# Altium project PaspberryPi_Breakout_V2_1.PrjPcb
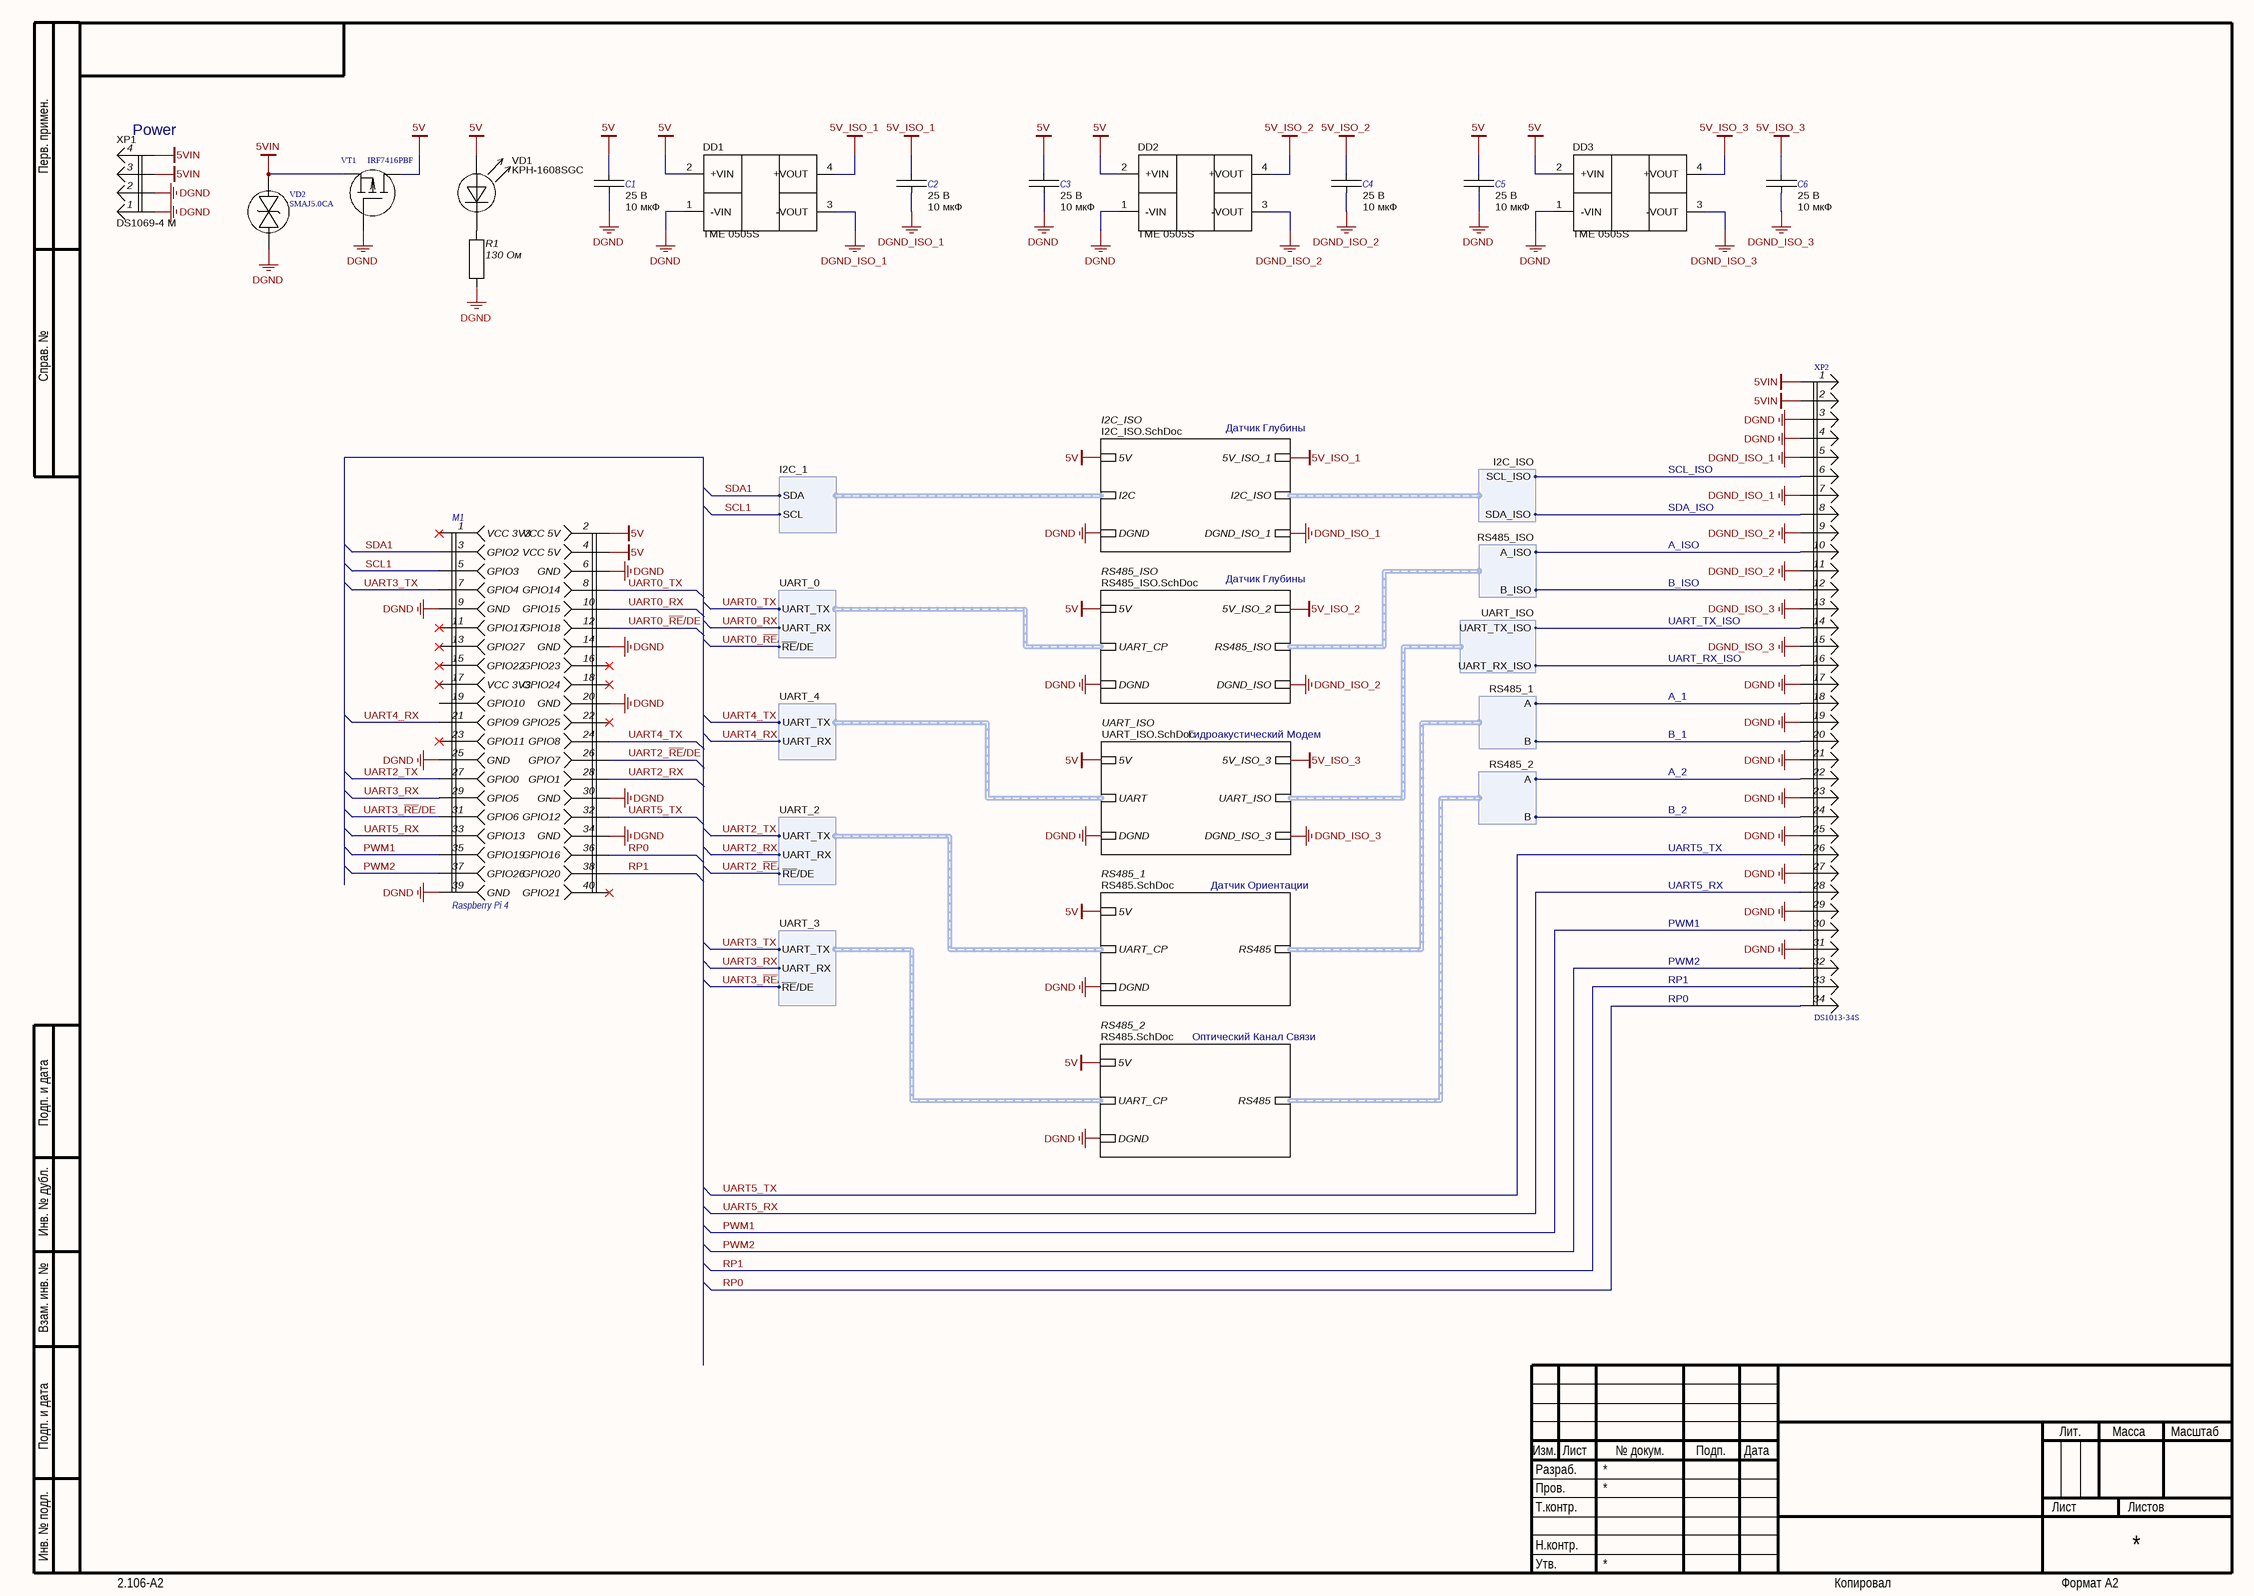
[diagram p0: Main.SchDoc]
5 sheets, 45 parts. Net scope: hierarchical (ports join the sheet entries above them; power ports are global).
Board file: PI4MB_HAT_V2_1.PcbDoc
Sheets:
  Main.SchDoc
    RS485_1 = RS485.SchDoc
    RS485_ISO = RS485_ISO.SchDoc
    UART_ISO = UART_ISO.SchDoc
    I2C_ISO = I2C_ISO.SchDoc
    RS485_2 = RS485.SchDoc

## Sheet Main.SchDoc
size 594 x 420 mm; Organization: Altium Limited; Address1: L3, 12a Rodborough Rd; Address2: Frenchs Forest; Address3: NSW; Address4: Australia 2086

### Parts
C1  Voltage: 25 В  [C1206C]  (hidden comment: 10 мкФ)
C2  Voltage: 25 В  [C1206C]  (hidden comment: 10 мкФ)
C3  Voltage: 25 В  [C1206C]  (hidden comment: 10 мкФ)
C4  Voltage: 25 В  [C1206C]  (hidden comment: 10 мкФ)
C5  Voltage: 25 В  [C1206C]  (hidden comment: 10 мкФ)
C6  Voltage: 25 В  [C1206C]  (hidden comment: 10 мкФ)
DD1  TME 0505S  [TME-1W-SINGLE]
DD2  TME 0505S  [TME-1W-SINGLE]
DD3  TME 0505S  [TME-1W-SINGLE]
M1  Raspberry Pi 4  [Raspberry Pi 4]
R1  130 Ом  [C0603R]
VD1  KPH-1608SGC  [LED_0603]
VD2  SMAJ5.0CA  [DO-214AC]
VT1  IRF7416PBF  [SOIC-8]
XP1  DS1069-4 M  [DS1069-4 M]
XP2  DS1013-34S  [IDC-34MS]

### Sub-sheets
I2C_ISO = I2C_ISO.SchDoc: DGND, 5V, I2C (harness I2C_1), 5V_ISO_1, I2C_ISO (harness I2C_ISO), DGND_ISO_1
RS485_1 = RS485.SchDoc: DGND, 5V, UART_CP (harness UART_2), RS485 (harness RS485_1)
RS485_2 = RS485.SchDoc: DGND, 5V, UART_CP (harness UART_3), RS485 (harness RS485_2)
RS485_ISO = RS485_ISO.SchDoc: DGND, 5V, UART_CP (harness UART_0), 5V_ISO_2, DGND_ISO, RS485_ISO (harness RS485_ISO)
UART_ISO = UART_ISO.SchDoc: DGND, 5V, UART (harness UART_4), DGND_ISO_3, UART_ISO (harness UART_ISO), 5V_ISO_3

### Harnesses
I2C_1: SDA, SCL
I2C_ISO: SDA_ISO, SCL_ISO
UART_2: UART_TX, UART_RX, ~{RE}/DE
UART_4: UART_TX, UART_RX
UART_0: UART_TX, UART_RX, ~{RE}/DE
UART_3: ~{RE}/DE, UART_RX, UART_TX
RS485_ISO: B_ISO, A_ISO
UART_ISO: UART_TX_ISO, UART_RX_ISO
RS485_1: B, A
RS485_2: B, A

### Nets
5V: C1.1 C3.1 C5.1 DD1.2(+VIN) DD2.2(+VIN) DD3.2(+VIN) M1.2(VCC_5V) M1.4(VCC_5V) VD1.2 VT1.5(D) ; sheet RS485_1/5V, sheet RS485_ISO/5V, sheet UART_ISO/5V, sheet I2C_ISO/5V, sheet RS485_2/5V
5V_ISO_1: C2.1 DD1.4(+VOUT) ; sheet I2C_ISO/5V_ISO_1
5V_ISO_2: C4.1 DD2.4(+VOUT) ; sheet RS485_ISO/5V_ISO_2
5V_ISO_3: C6.1 DD3.4(+VOUT) ; sheet UART_ISO/5V_ISO_3
5VIN: VD2.1(C) VT1.1(S) XP1.3 XP1.4 XP2.1 XP2.2
D: VT1.6(D) VT1.7(D) VT1.8(D)
DGND: C1.2 C3.2 C5.2 DD1.1(-VIN) DD2.1(-VIN) DD3.1(-VIN) M1.6(GND) M1.9(GND) M1.14(GND) M1.20(GND) M1.25(GND) M1.30(GND) M1.34(GND) M1.39(GND) R1.2 VD2.2(A) VT1.4(G) XP1.1 XP1.2 XP2.3 XP2.4 XP2.17 XP2.19 XP2.21 XP2.23 XP2.25 XP2.27 XP2.29 XP2.31 ; sheet RS485_1/DGND, sheet RS485_ISO/DGND, sheet UART_ISO/DGND, sheet I2C_ISO/DGND, sheet RS485_2/DGND
DGND_ISO_1: C2.2 DD1.3(-VOUT) XP2.5 XP2.7 ; sheet I2C_ISO/DGND_ISO_1
DGND_ISO_2: C4.2 DD2.3(-VOUT) XP2.9 XP2.11 ; sheet RS485_ISO/DGND_ISO
DGND_ISO_3: C6.2 DD3.3(-VOUT) XP2.13 XP2.15 ; sheet UART_ISO/DGND_ISO_3
S: VT1.2(S) VT1.3(S)
PWM1: M1.35(GPIO19) XP2.30
PWM2: M1.37(GPIO26) XP2.32
RP0: M1.36(GPIO16) XP2.34
RP1: M1.38(GPIO20) XP2.33
SCL1: M1.5(GPIO3) ; sheet I2C_ISO/I2C.SCL
SDA1: M1.3(GPIO2) ; sheet I2C_ISO/I2C.SDA
UART0_~{RE}/DE: M1.12(GPIO18) ; sheet RS485_ISO/UART_CP.~{RE}/DE
UART0_RX: M1.10(GPIO15) ; sheet RS485_ISO/UART_CP.UART_RX
UART0_TX: M1.8(GPIO14) ; sheet RS485_ISO/UART_CP.UART_TX
UART2_~{RE}/DE: M1.26(GPIO7) ; sheet RS485_1/UART_CP.~{RE}/DE
UART2_RX: M1.28(GPIO1) ; sheet RS485_1/UART_CP.UART_RX
UART2_TX: M1.27(GPIO0) ; sheet RS485_1/UART_CP.UART_TX
UART3_~{RE}/DE: M1.31(GPIO6) ; sheet RS485_2/UART_CP.~{RE}/DE
UART3_RX: M1.29(GPIO5) ; sheet RS485_2/UART_CP.UART_RX
UART3_TX: M1.7(GPIO4) ; sheet RS485_2/UART_CP.UART_TX
UART4_RX: M1.21(GPIO9) ; sheet UART_ISO/UART.UART_RX
UART4_TX: M1.24(GPIO8) ; sheet UART_ISO/UART.UART_TX
UART5_RX: M1.33(GPIO13) XP2.28
UART5_TX: M1.32(GPIO12) XP2.26
NetDD5_6: XP2.6 ; sheet I2C_ISO/I2C_ISO.SCL_ISO
NetDD5_7: XP2.8 ; sheet I2C_ISO/I2C_ISO.SDA_ISO
NetDD6_12: XP2.10 ; sheet RS485_ISO/RS485_ISO.A_ISO
NetDD6_13: XP2.12 ; sheet RS485_ISO/RS485_ISO.B_ISO
NetDD6_RS485_1_6: XP2.18 ; sheet RS485_1/RS485.A
NetDD6_RS485_1_7: XP2.20 ; sheet RS485_1/RS485.B
NetDD6_RS485_2_6: XP2.22 ; sheet RS485_2/RS485.A
NetDD6_RS485_2_7: XP2.24 ; sheet RS485_2/RS485.B
NetDD8_6: XP2.14 ; sheet UART_ISO/UART_ISO.UART_TX_ISO
NetDD8_7: XP2.16 ; sheet UART_ISO/UART_ISO.UART_RX_ISO
NetR1_1: R1.1 VD1.1

Not connected (* = marked no-connect by the designer): M1 1(VCC_3V3)* 11(GPIO17)* 13(GPIO27)* 15(GPIO22)* 16(GPIO23)* 17(VCC_3V3)* 18(GPIO24)* 19(GPIO10) 22(GPIO25)* 23(GPIO11)* 40(GPIO21)*

### Notes on the sheet
- (near XP1) Power
- Датчик Глубины
- SCL_ISO
- SDA_ISO
- A_ISO
- B_ISO
- UART_TX_ISO
- UART_RX_ISO
- A_1
- Гидроакустический Модем
- B_1
- A_2
- B_2
- Датчик Ориентации
- UART5_TX
- UART5_RX
- PWM1
- PWM2
- RP1
- RP0
- Оптический Канал Связи
- Перв. примен.
- Справ. №
- Подп. и дата
- Инв. № дубл.
- Взам. инв. №
- Разраб.
- Изм.
- Лист
- № докум.
- Подп.
- Дата
- Лит.
- Масса
- Масштаб
- Пров.
- Т.контр.
- Листов
- Инв. № подл.
- Утв.
- Н.контр.
- 2.106-A2
- Копировал
- Формат А2

### Library data of the parts
C1-C6 = CC1206KKX7R8BB106: SMD 1206; X7R; 10 мкФ; 25 В; Manufacturer: YAGEO; Persent: ±15%; Type: Ceramic; Part Number: CC1206KKX7R8BB106; Package: SMD 1206; Dielectric: X7R; ComponentLink1Description: Datasheet; Value: 10 мкФ
DD1-DD3 = TME 0505S: Switching regulator, 5V; Manufacturer: Traco Power; Part Number: TME 0505S; Type: ISO DC/DC
R1 = RC0603FR-07130RL: SMD 0603; 0,1; 1%; 130 Ом; Manufacturer: Yageo; Power: 0,1; Part Number: RC0603FR-07130RL; Package: SMD 0603; Persent: 1%; Value: 130 Ом; Category: R
VD1 = KPH-1608SGC: 0603 LED GREEN 10 ucd; Manufacturer: Kingbright; Part Number: KPH-1608SGC; Type: LED
VD2 = SMAJ5.0CA: TVS 5 В; Manufacturer: BOURNS; Voltage: 5V; Power: 400W; Part Number: SMAJ5.0CA; Type: TVS
VT1 = IRF7416PBF: P MOSFET; Manufacturer: Infineon; Part Number: IRF7416PBF; Type: MOSFET; Сharacter: P
XP1 = DS1069-4 M: Manufacturer: Connfly; Part Number: DS1069-4 M
XP2 = DS1013-34S: IDC; Manufacturer: Connfly; Part Number: DS1013-34S; Type: IDC
M1 = Raspberry Pi 4: Part Number: Raspberry Pi 4; Type: Module; ComponentLink1Description: Datasheet; Manufacturer: Raspberry

## Sheet RS485.SchDoc
size 420 x 297 mm; Organization: Altium Limited; Address1: L3, 12a Rodborough Rd; Address2: Frenchs Forest; Address3: NSW; Address4: Australia 2086
Used 2 times, as channels RS485_1, RS485_2. Parts and nets are listed once, with the designators drawn on the sheet.
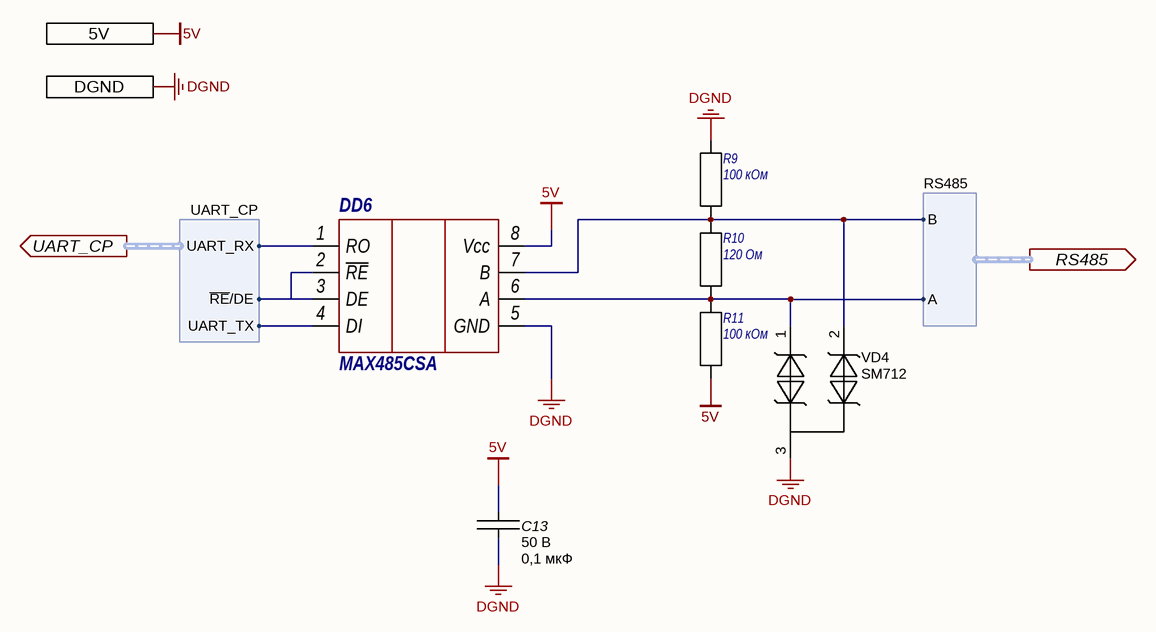
[diagram p1: RS485.SchDoc]

### Parts
C13  Voltage: 50 В  [C0603C]  (hidden comment: 0,1 мкФ)
DD6  MAX485CSA  [SOIC-8]
R9  100 кОм  [C0603R]
R10  120 Ом  [C0603R]
R11  100 кОм  [C0603R]
VD4  SM712  [SOT23-3]

### Ports
5V, DGND, RS485 (out, harness RS485), UART_CP (out, harness UART_CP)

### Harnesses
UART_CP: UART_TX, UART_RX, ~{RE}/DE
RS485: B, A

### Nets
5V: C13.1 DD6.8(Vcc) R11.2 ; port 5V
DGND: C13.2 DD6.5(GND) R9.1 VD4.3 ; port DGND
NetDD6_1: DD6.1(RO) ; port UART_CP.UART_RX
NetDD6_2: DD6.2(~{RE}) DD6.3(DE) ; port UART_CP.~{RE}/DE
NetDD6_4: DD6.4(DI) ; port UART_CP.UART_TX
NetDD6_6: DD6.6(A) R10.2 R11.1 VD4.1 ; port RS485.A
NetDD6_7: DD6.7(B) R9.2 R10.1 VD4.2 ; port RS485.B

### Channels
RS485_1: designators end in _RS485_1; ports 5V=5V DGND=DGND
RS485_2: designators end in _RS485_2; ports 5V=5V DGND=DGND

### Notes on the sheet
- Подп. и дата
- Инв. № дубл.
- Взам. инв. №
- Инв. № подл.
- Изм.
- Лист
- № докум.
- Подп.
- Дата
- 2.106-A3
- Копировал
- Формат А3

### Library data of the parts
C13 = CC0603KRX7R9BB104: SMD 0603 ; X7R; 0,1 мкФ; 50 В; Manufacturer: YAGEO; Persent: ±5%; Type: Ceramic; Part Number: CC0603KRX7R9BB104; Package: SMD 0603; Dielectric: X7R; ComponentLink1Description: Datasheet; Value: 0,1 мкФ
DD6 = MAX485CSA: RS-485 приёмопередатчик; Part Number: MAX485CSA
R9 R11 = RC0603FR-07100KL: SMD 0603; 0,1; 1%; 100 кОм; Manufacturer: Yageo; Power: 0,1; Part Number: RC0603FR-07100KL; Package: SMD 0603; Persent: 1%; Value: 100 кОм; Category: R
R10 = RC0603FR-07120RL: SMD 0603; 0,1; 1%; 120 Ом; Manufacturer: Yageo; Power: 0,1; Part Number: RC0603FR-07120RL; Package: SMD 0603; Persent: 1%; Value: 120 Ом; Category: R
VD4 = SM712.TCT: TVS RS485; Manufacturer: Semtech; Part Number: SM712.TCT; Type: TVS

## Sheet RS485_ISO.SchDoc
size 420 x 297 mm; Organization: Altium Limited; Address1: L3, 12a Rodborough Rd; Address2: Frenchs Forest; Address3: NSW; Address4: Australia 2086
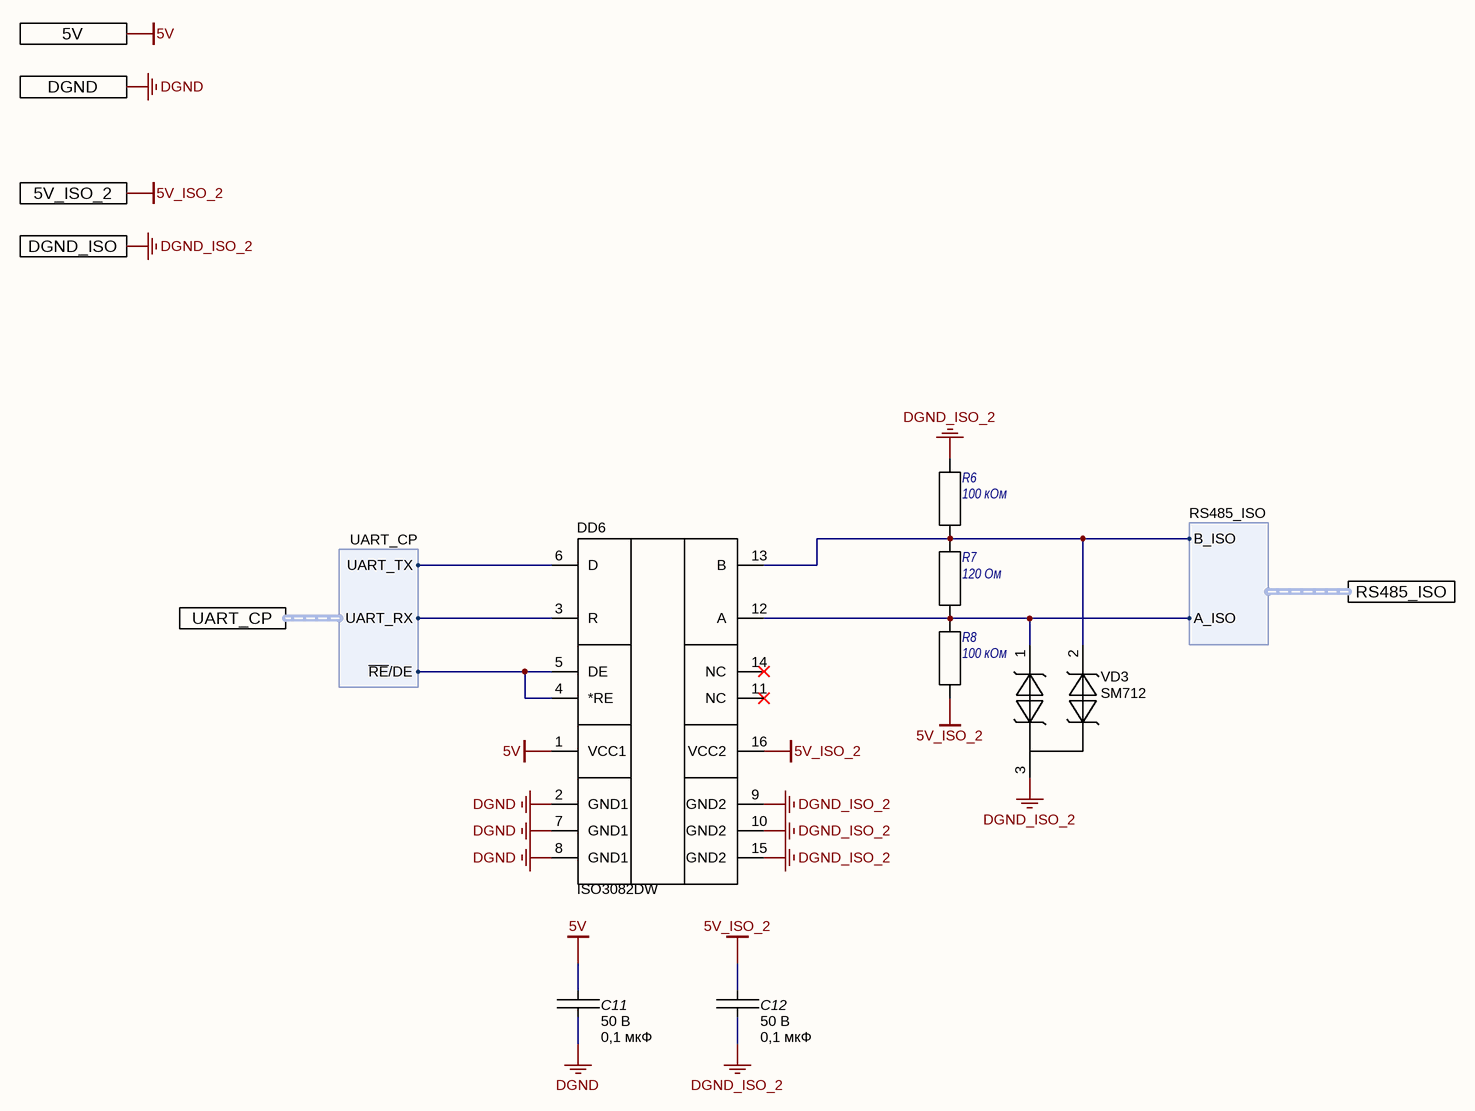
[diagram p2: RS485_ISO.SchDoc]

### Parts
C11  Voltage: 50 В  [C0603C]  (hidden comment: 0,1 мкФ)
C12  Voltage: 50 В  [C0603C]  (hidden comment: 0,1 мкФ)
DD6  ISO3082DW  [SOIC-Wide-16]
R6  100 кОм  [C0603R]
R7  120 Ом  [C0603R]
R8  100 кОм  [C0603R]
VD3  SM712  [SOT23-3]

### Ports
5V, 5V_ISO_2, DGND, DGND_ISO, RS485_ISO (harness RS485_ISO), UART_CP (harness UART_CP)

### Harnesses
UART_CP: UART_TX, UART_RX, ~{RE}/DE
RS485_ISO: B_ISO, A_ISO

### Nets
5V: C11.1 DD6.1(VCC1) ; port 5V
5V_ISO_2: C12.1 DD6.16(VCC2) R8.2 ; port 5V_ISO_2
DGND: C11.2 DD6.2(GND1) DD6.7(GND1) DD6.8(GND1) ; port DGND
DGND_ISO_2: C12.2 DD6.9(GND2) DD6.10(GND2) DD6.15(GND2) R6.1 VD3.3 ; port DGND_ISO
UART0_~{RE}/DE: DD6.4(*RE) DD6.5(DE) ; port UART_CP.~{RE}/DE
UART0_RX: DD6.3(R) ; port UART_CP.UART_RX
UART0_TX: DD6.6(D) ; port UART_CP.UART_TX
NetDD6_12: DD6.12(A) R7.2 R8.1 VD3.1 ; port RS485_ISO.A_ISO
NetDD6_13: DD6.13(B) R6.2 R7.1 VD3.2 ; port RS485_ISO.B_ISO

Not connected (* = marked no-connect by the designer): DD6 11(NC)* 14(NC)*

### Notes on the sheet
- Подп. и дата
- Инв. № дубл.
- Взам. инв. №
- Инв. № подл.
- Изм.
- Лист
- № докум.
- Подп.
- Дата
- 2.106-A3
- Копировал
- Формат А3

### Library data of the parts
C11 C12 = CC0603KRX7R9BB104: as C13 on sheet RS485; Part Number: CC0603KRX7R9BB104; Package: SMD 0603; Dielectric: X7R; ComponentLink1Description: Datasheet; Value: 0,1 мкФ
DD6 = ISO3082DW: RS-485 Transceivers; Manufacturer: Texas Instruments; Part Number: ISO3082DW; Type: Special
R6 R8 = RC0603FR-07100KL: as R9 on sheet RS485; Part Number: RC0603FR-07100KL; Package: SMD 0603; Persent: 1%; Value: 100 кОм; Category: R
R7 = RC0603FR-07120RL: as R10 on sheet RS485; Part Number: RC0603FR-07120RL; Package: SMD 0603; Persent: 1%; Value: 120 Ом; Category: R
VD3 = SM712.TCT: TVS RS485; Manufacturer: Semtech; Part Number: SM712.TCT; Type: TVS

## Sheet UART_ISO.SchDoc
size 209 x 297 mm; Organization: Altium Limited; Address1: L3, 12a Rodborough Rd; Address2: Frenchs Forest; Address3: NSW; Address4: Australia 2086
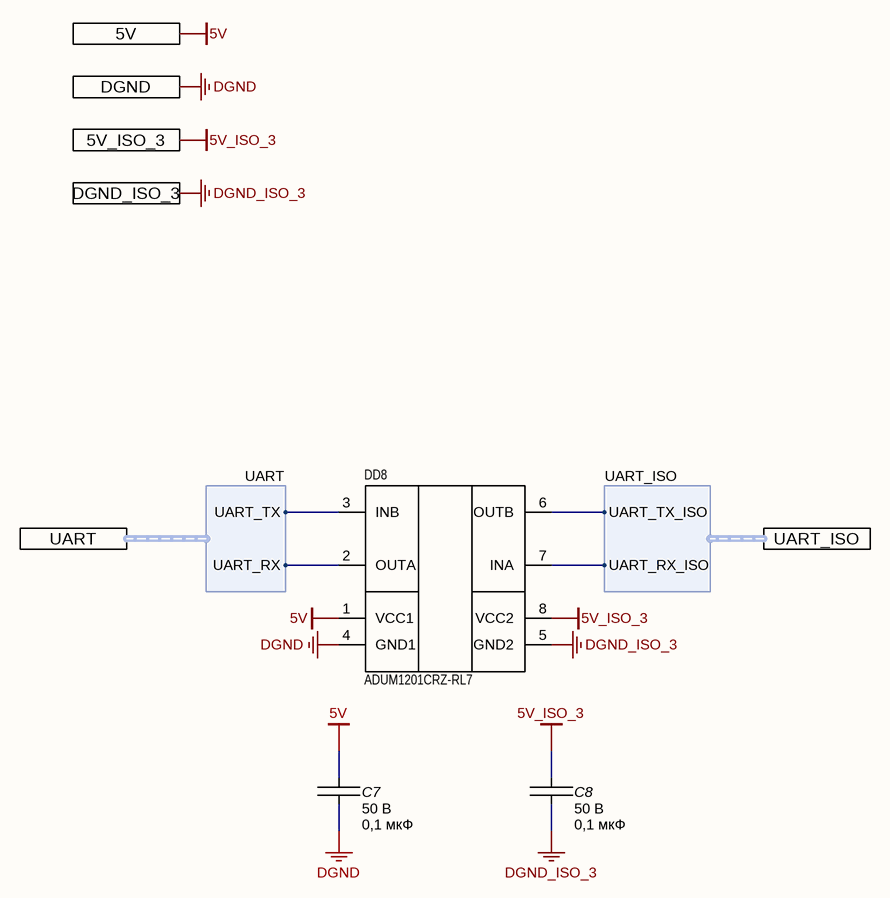
[diagram p3: UART_ISO.SchDoc]

### Parts
C7  Voltage: 50 В  [C0603C]  (hidden comment: 0,1 мкФ)
C8  Voltage: 50 В  [C0603C]  (hidden comment: 0,1 мкФ)
DD8  ADUM1201CRZ-RL7  [SOIC-8]

### Ports
5V, 5V_ISO_3, DGND, DGND_ISO_3, UART (harness UART), UART_ISO (harness UART_ISO)

### Harnesses
UART: UART_TX, UART_RX
UART_ISO: UART_TX_ISO, UART_RX_ISO

### Nets
5V: C7.1 DD8.1(VCC1) ; port 5V
5V_ISO_3: C8.1 DD8.8(VCC2) ; port 5V_ISO_3
DGND: C7.2 DD8.4(GND1) ; port DGND
DGND_ISO_3: C8.2 DD8.5(GND2) ; port DGND_ISO_3
UART4_RX: DD8.2(OUTA) ; port UART.UART_RX
UART4_TX: DD8.3(INB) ; port UART.UART_TX
NetDD8_6: DD8.6(OUTB) ; port UART_ISO.UART_TX_ISO
NetDD8_7: DD8.7(INA) ; port UART_ISO.UART_RX_ISO

### Notes on the sheet
- Подп. и дата
- Инв. № дубл.
- Взам. инв. №
- Инв. № подл.
- Изм.
- Лист
- № докум.
- Подп.
- Дата
- Форма 2а ГОСТ 2.104-2006
- Копировал
- Формат А4

### Library data of the parts
C7 C8 = CC0603KRX7R9BB104: as C13 on sheet RS485; Part Number: CC0603KRX7R9BB104; Package: SMD 0603; Dielectric: X7R; ComponentLink1Description: Datasheet; Value: 0,1 мкФ
DD8 = ADUM1201CRZ-RL7: Цифровой изолятор 2.5кВ, 2 канала, 1/1

## Sheet I2C_ISO.SchDoc
size 420 x 297 mm; Organization: Altium Limited; Address1: L3, 12a Rodborough Rd; Address2: Frenchs Forest; Address3: NSW; Address4: Australia 2086
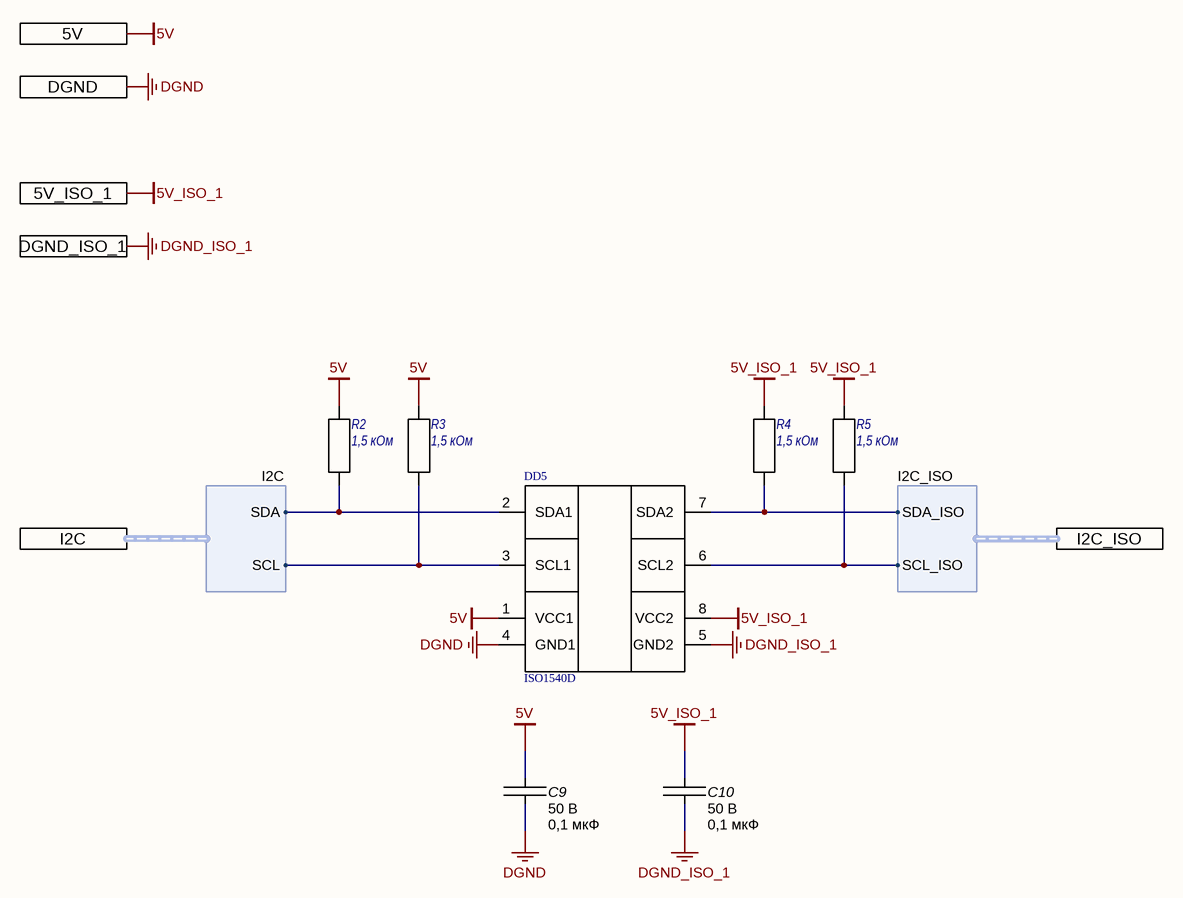
[diagram p4: I2C_ISO.SchDoc]

### Parts
C9  Voltage: 50 В  [C0603C]  (hidden comment: 0,1 мкФ)
C10  Voltage: 50 В  [C0603C]  (hidden comment: 0,1 мкФ)
DD5  ISO1540D  [SOIC-8]
R2  1,5 кОм  [C0603R]
R3  1,5 кОм  [C0603R]
R4  1,5 кОм  [C0603R]
R5  1,5 кОм  [C0603R]

### Ports
5V, 5V_ISO_1, DGND, DGND_ISO_1, I2C (harness I2C), I2C_ISO (harness I2C_ISO)

### Harnesses
I2C: SDA, SCL
I2C_ISO: SDA_ISO, SCL_ISO

### Nets
5V: C9.1 DD5.1(VCC1) R2.2 R3.2 ; port 5V
5V_ISO_1: C10.1 DD5.8(VCC2) R4.2 R5.2 ; port 5V_ISO_1
DGND: C9.2 DD5.4(GND1) ; port DGND
DGND_ISO_1: C10.2 DD5.5(GND2) ; port DGND_ISO_1
SCL1: DD5.3(SCL1) R3.1 ; port I2C.SCL
SDA1: DD5.2(SDA1) R2.1 ; port I2C.SDA
NetDD5_6: DD5.6(SCL2) R5.1 ; port I2C_ISO.SCL_ISO
NetDD5_7: DD5.7(SDA2) R4.1 ; port I2C_ISO.SDA_ISO

### Notes on the sheet
- Подп. и дата
- Инв. № дубл.
- Взам. инв. №
- Инв. № подл.
- Изм.
- Лист
- № докум.
- Подп.
- Дата
- 2.106-A3
- Копировал
- Формат А3

### Library data of the parts
C9 C10 = CC0603KRX7R9BB104: as C13 on sheet RS485; Part Number: CC0603KRX7R9BB104; Package: SMD 0603; Dielectric: X7R; ComponentLink1Description: Datasheet; Value: 0,1 мкФ
DD5 = ISO1540D: I2C ISO; Manufacturer: Texas Instruments; Part Number: ISO1540D; Type: ISO
R2-R5 = RC0603FR-071K5L: SMD 0603; 0,1; 1%; 1,5 кОм; Manufacturer: Yageo; Power: 0,1; Part Number: RC0603FR-071K5L; Package: SMD 0603; Persent: 1%; Value: 1,5 кОм; Category: R

## Nets that join several sheets
5V: Main (10 pins), RS485_1 (C13_RS485_1.1 DD6_RS485_1.8 R11_RS485_1.2), RS485_ISO (C11.1 DD6.1), UART_ISO (C7.1 DD8.1), I2C_ISO (C9.1 DD5.1 R2.2 R3.2), RS485_2 (C13_RS485_2.1 DD6_RS485_2.8 R11_RS485_2.2)
5V_ISO_1: Main (C2.1 DD1.4), I2C_ISO (C10.1 DD5.8 R4.2 R5.2)
5V_ISO_2: Main (C4.1 DD2.4), RS485_ISO (C12.1 DD6.16 R8.2)
5V_ISO_3: Main (C6.1 DD3.4), UART_ISO (C8.1 DD8.8)
DGND: Main (29 pins), RS485_1 (C13_RS485_1.2 DD6_RS485_1.5 R9_RS485_1.1 VD4_RS485_1.3), RS485_ISO (C11.2 DD6.2 DD6.7 DD6.8), UART_ISO (C7.2 DD8.4), I2C_ISO (C9.2 DD5.4), RS485_2 (C13_RS485_2.2 DD6_RS485_2.5 R9_RS485_2.1 VD4_RS485_2.3)
DGND_ISO_1: Main (C2.2 DD1.3 XP2.5 XP2.7), I2C_ISO (C10.2 DD5.5)
DGND_ISO_2: Main (C4.2 DD2.3 XP2.9 XP2.11), RS485_ISO (6 pins)
DGND_ISO_3: Main (C6.2 DD3.3 XP2.13 XP2.15), UART_ISO (C8.2 DD8.5)
NetDD5_6: Main (XP2.6), I2C_ISO (DD5.6 R5.1)
NetDD5_7: Main (XP2.8), I2C_ISO (DD5.7 R4.1)
NetDD6_12: Main (XP2.10), RS485_ISO (DD6.12 R7.2 R8.1 VD3.1)
NetDD6_13: Main (XP2.12), RS485_ISO (DD6.13 R6.2 R7.1 VD3.2)
NetDD6_RS485_1_6: Main (XP2.18), RS485_1 (DD6_RS485_1.6 R10_RS485_1.2 R11_RS485_1.1 VD4_RS485_1.1)
NetDD6_RS485_1_7: Main (XP2.20), RS485_1 (DD6_RS485_1.7 R9_RS485_1.2 R10_RS485_1.1 VD4_RS485_1.2)
NetDD6_RS485_2_6: Main (XP2.22), RS485_2 (DD6_RS485_2.6 R10_RS485_2.2 R11_RS485_2.1 VD4_RS485_2.1)
NetDD6_RS485_2_7: Main (XP2.24), RS485_2 (DD6_RS485_2.7 R9_RS485_2.2 R10_RS485_2.1 VD4_RS485_2.2)
NetDD8_6: Main (XP2.14), UART_ISO (DD8.6)
NetDD8_7: Main (XP2.16), UART_ISO (DD8.7)
SCL1: Main (M1.5), I2C_ISO (DD5.3 R3.1)
SDA1: Main (M1.3), I2C_ISO (DD5.2 R2.1)
UART0_~{RE}/DE: Main (M1.12), RS485_ISO (DD6.4 DD6.5)
UART0_RX: Main (M1.10), RS485_ISO (DD6.3)
UART0_TX: Main (M1.8), RS485_ISO (DD6.6)
UART2_~{RE}/DE: Main (M1.26), RS485_1 (DD6_RS485_1.2 DD6_RS485_1.3)
UART2_RX: Main (M1.28), RS485_1 (DD6_RS485_1.1)
UART2_TX: Main (M1.27), RS485_1 (DD6_RS485_1.4)
UART3_~{RE}/DE: Main (M1.31), RS485_2 (DD6_RS485_2.2 DD6_RS485_2.3)
UART3_RX: Main (M1.29), RS485_2 (DD6_RS485_2.1)
UART3_TX: Main (M1.7), RS485_2 (DD6_RS485_2.4)
UART4_RX: Main (M1.21), UART_ISO (DD8.2)
UART4_TX: Main (M1.24), UART_ISO (DD8.3)